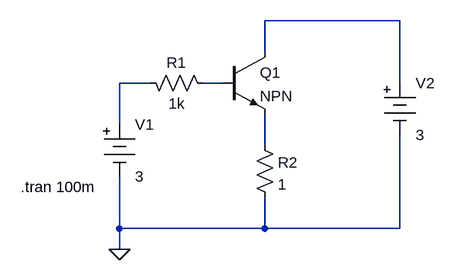
[diagram p0: schematic Yoneda-p94__Transistor.asc]
Yoneda-p94__Transistor.asc, the LTspice schematic file:
Version 4
SHEET 1 880 680
WIRE 496 -32 288 -32
WIRE 288 16 288 -32
WIRE 112 64 64 64
WIRE 224 64 192 64
WIRE 496 64 496 -32
WIRE 64 128 64 64
WIRE 288 160 288 112
WIRE 64 288 64 208
WIRE 288 288 288 240
WIRE 288 288 64 288
WIRE 496 288 496 144
WIRE 496 288 288 288
WIRE 64 320 64 288
FLAG 64 320 0
SYMBOL Misc\\battery 64 112 R0
SYMATTR InstName V1
SYMATTR Value 3
SYMBOL res 208 80 M270
WINDOW 0 32 56 VTop 2
WINDOW 3 0 56 VBottom 2
SYMATTR InstName R1
SYMATTR Value 1k
SYMBOL res 272 144 R0
WINDOW 0 36 42 Left 2
SYMATTR InstName R2
SYMATTR Value 1
SYMBOL Misc\\battery 496 48 R0
SYMATTR InstName V2
SYMATTR Value 3
SYMBOL npn 224 16 R0
SYMATTR InstName Q1
TEXT -88 224 Left 2 !.tran 100m

The netlist it stands for:
* Yoneda-p94__Transistor.asc
V1 N002 0 3
R1 N003 N002 1k
R2 N004 0 1
V2 N001 0 3
Q1 N001 N003 N004 0 NPN
.model NPN NPN
.model PNP PNP
.lib standard.bjt
.tran 100m
.backanno
.end